# EAGLE schematic Esquematico (EAGLE 9.7.0)
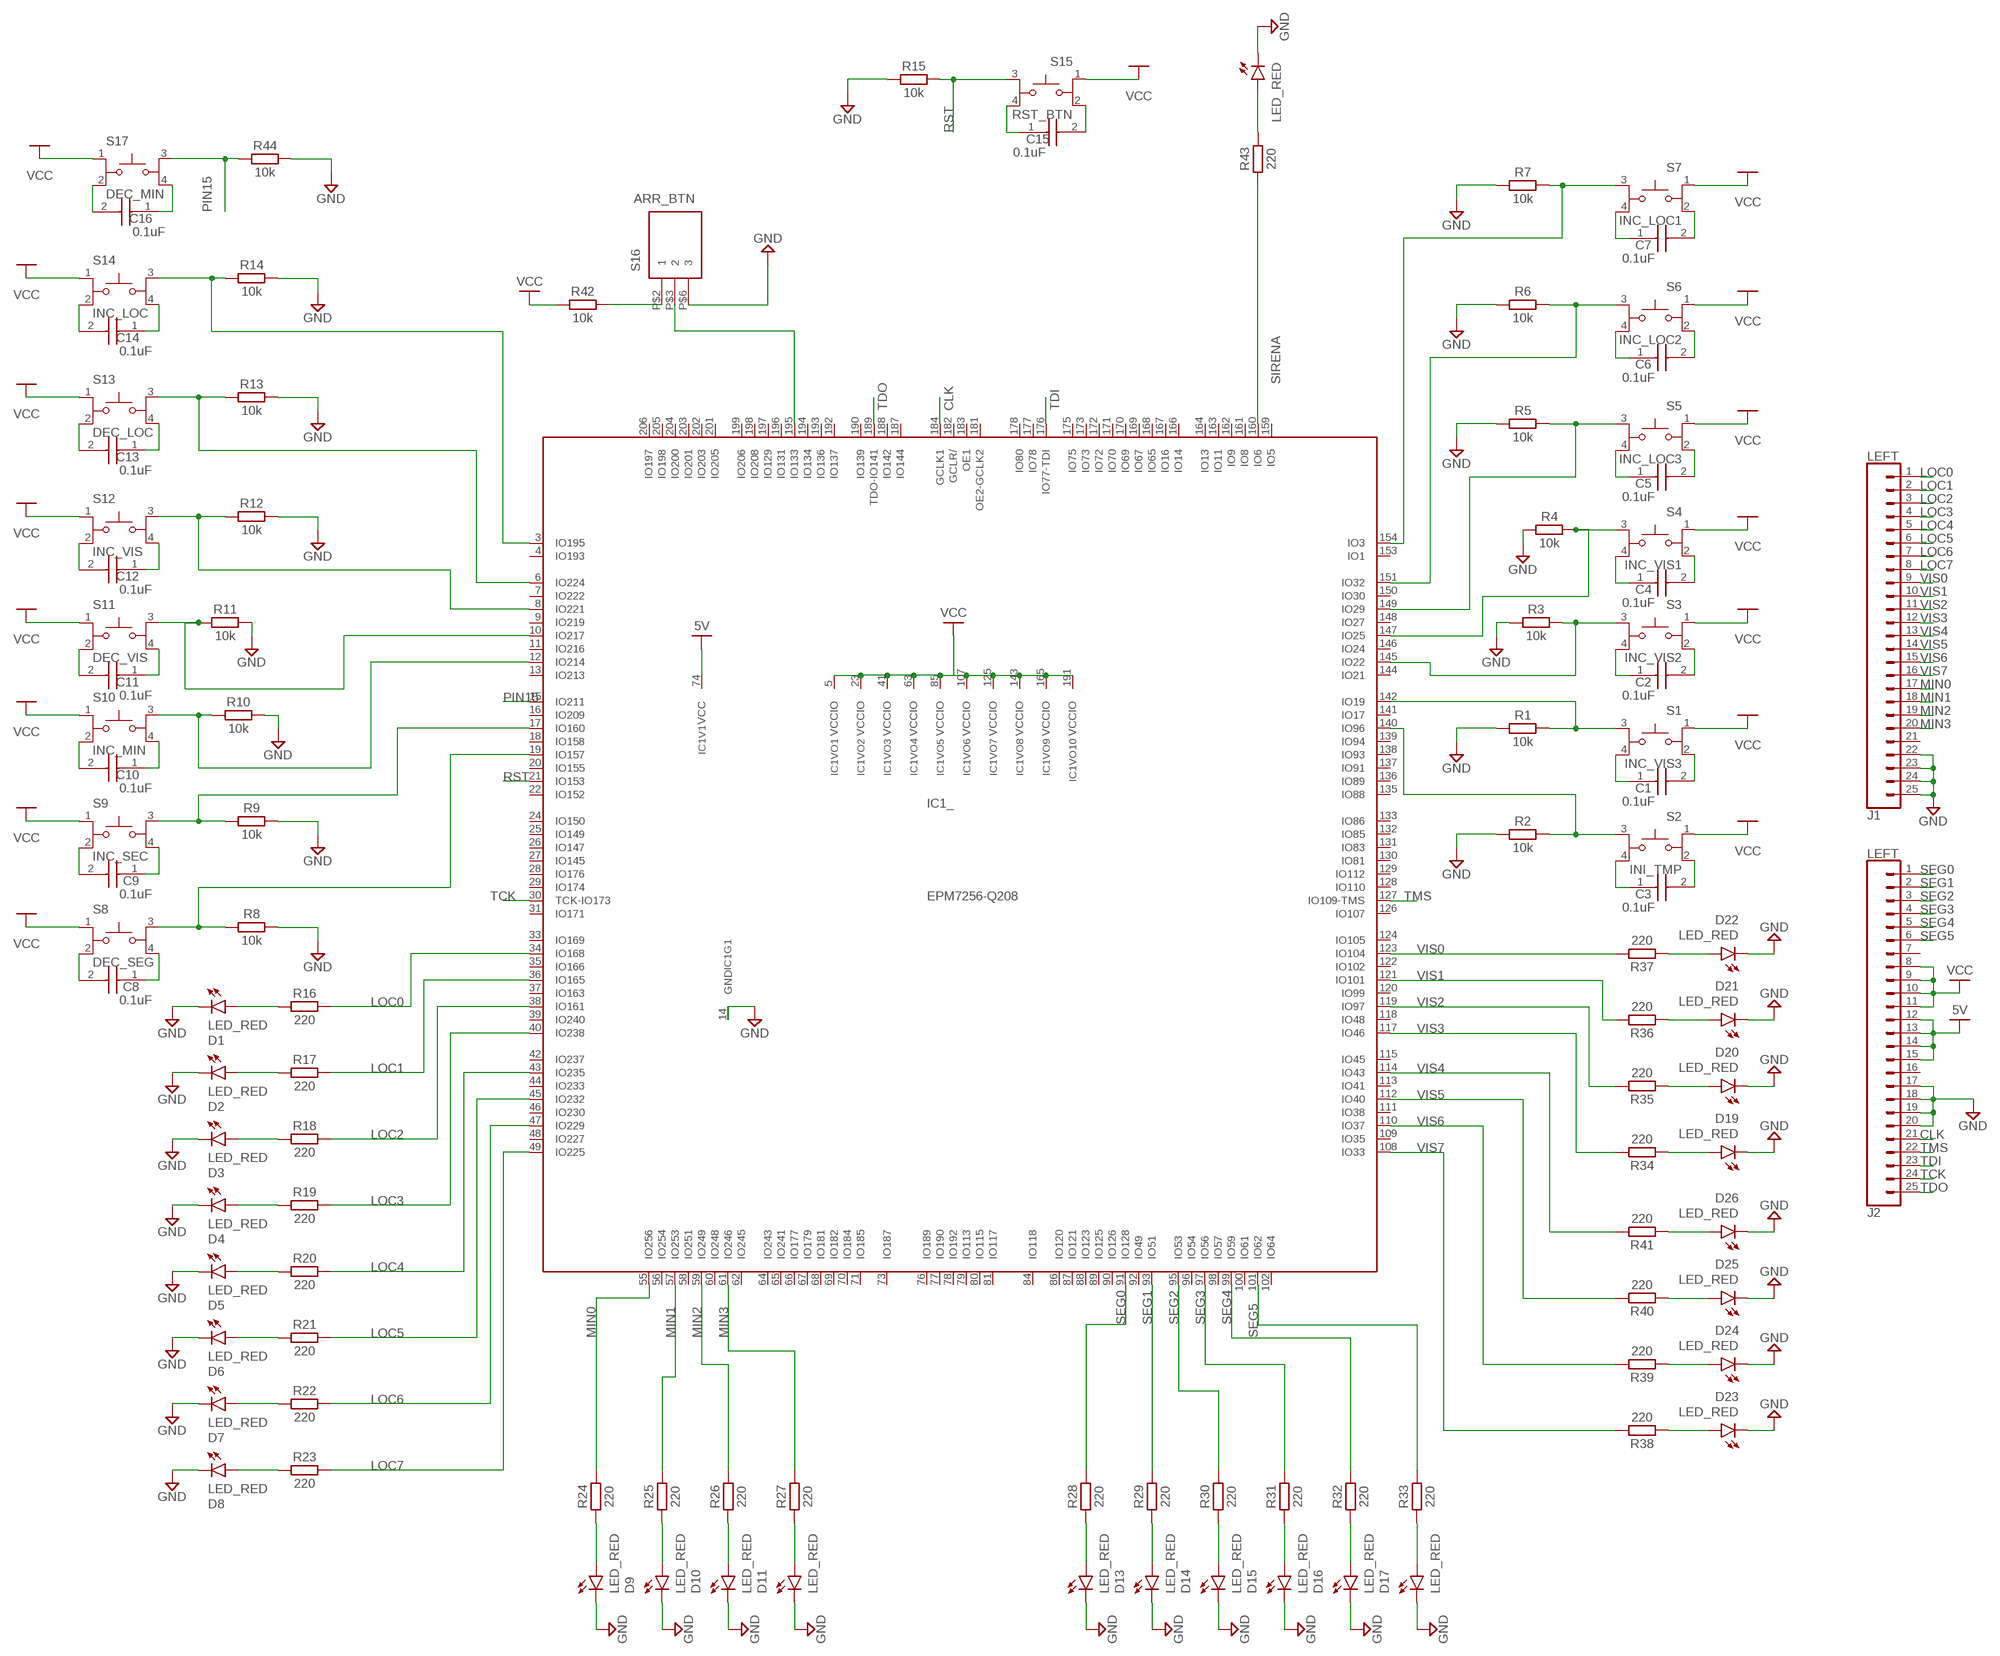
[diagram p0: schematic, sheet 1]

## Parts
C1  0.1uF  K104K15X7RF53H5  [K104K15X7RF53H5]
C2  0.1uF  K104K15X7RF53H5  [K104K15X7RF53H5]
C3  0.1uF  K104K15X7RF53H5  [K104K15X7RF53H5]
C4  0.1uF  K104K15X7RF53H5  [K104K15X7RF53H5]
C5  0.1uF  K104K15X7RF53H5  [K104K15X7RF53H5]
C6  0.1uF  K104K15X7RF53H5  [K104K15X7RF53H5]
C7  0.1uF  K104K15X7RF53H5  [K104K15X7RF53H5]
C8  0.1uF  K104K15X7RF53H5  [K104K15X7RF53H5]
C9  0.1uF  K104K15X7RF53H5  [K104K15X7RF53H5]
C10  0.1uF  K104K15X7RF53H5  [K104K15X7RF53H5]
C11  0.1uF  K104K15X7RF53H5  [K104K15X7RF53H5]
C12  0.1uF  K104K15X7RF53H5  [K104K15X7RF53H5]
C13  0.1uF  K104K15X7RF53H5  [K104K15X7RF53H5]
C14  0.1uF  K104K15X7RF53H5  [K104K15X7RF53H5]
C15  0.1uF  K104K15X7RF53H5  [K104K15X7RF53H5]
C16  0.1uF  K104K15X7RF53H5  [K104K15X7RF53H5]
D1  LED_RED  LED_RADIAL_RED  [LEDRD254W60D565H860B]
D2  LED_RED  LED_RADIAL_RED  [LEDRD254W60D565H860B]
D3  LED_RED  LED_RADIAL_RED  [LEDRD254W60D565H860B]
D4  LED_RED  LED_RADIAL_RED  [LEDRD254W60D565H860B]
D5  LED_RED  LED_RADIAL_RED  [LEDRD254W60D565H860B]
D6  LED_RED  LED_RADIAL_RED  [LEDRD254W60D565H860B]
D7  LED_RED  LED_RADIAL_RED  [LEDRD254W60D565H860B]
D8  LED_RED  LED_RADIAL_RED  [LEDRD254W60D565H860B]
D9  LED_RED  LED_RADIAL_RED  [LEDRD254W60D565H860B]
D10  LED_RED  LED_RADIAL_RED  [LEDRD254W60D565H860B]
D11  LED_RED  LED_RADIAL_RED  [LEDRD254W60D565H860B]
D12  LED_RED  LED_RADIAL_RED  [LEDRD254W60D565H860B]
D13  LED_RED  LED_RADIAL_RED  [LEDRD254W60D565H860B]
D14  LED_RED  LED_RADIAL_RED  [LEDRD254W60D565H860B]
D15  LED_RED  LED_RADIAL_RED  [LEDRD254W60D565H860B]
D16  LED_RED  LED_RADIAL_RED  [LEDRD254W60D565H860B]
D17  LED_RED  LED_RADIAL_RED  [LEDRD254W60D565H860B]
D18  LED_RED  LED_RADIAL_RED  [LEDRD254W60D565H860B]
D19  LED_RED  LED_RADIAL_RED  [LEDRD254W60D565H860B]
D20  LED_RED  LED_RADIAL_RED  [LEDRD254W60D565H860B]
D21  LED_RED  LED_RADIAL_RED  [LEDRD254W60D565H860B]
D22  LED_RED  LED_RADIAL_RED  [LEDRD254W60D565H860B]
D23  LED_RED  LED_RADIAL_RED  [LEDRD254W60D565H860B]
D24  LED_RED  LED_RADIAL_RED  [LEDRD254W60D565H860B]
D25  LED_RED  LED_RADIAL_RED  [LEDRD254W60D565H860B]
D26  LED_RED  LED_RADIAL_RED  [LEDRD254W60D565H860B]
D27  LED_RED  LED_RADIAL_RED  [LEDRD254W60D565H860B]
IC1  EPM7256-Q208  [RQFP208]
J1  LEFT  CONN_25PTH_LONGPADS  [1X25_LONGPAD]
J2  LEFT  CONN_25PTH_LONGPADS  [1X25_LONGPAD]
R1  10k  R_AXIAL-7.2MM-PITCH  [RESAD724W46L381D178B]
R2  10k  R_AXIAL-7.2MM-PITCH  [RESAD724W46L381D178B]
R3  10k  R_AXIAL-7.2MM-PITCH  [RESAD724W46L381D178B]
R4  10k  R_AXIAL-7.2MM-PITCH  [RESAD724W46L381D178B]
R5  10k  R_AXIAL-7.2MM-PITCH  [RESAD724W46L381D178B]
R6  10k  R_AXIAL-7.2MM-PITCH  [RESAD724W46L381D178B]
R7  10k  R_AXIAL-7.2MM-PITCH  [RESAD724W46L381D178B]
R8  10k  R_AXIAL-7.2MM-PITCH  [RESAD724W46L381D178B]
R9  10k  R_AXIAL-7.2MM-PITCH  [RESAD724W46L381D178B]
R10  10k  R_AXIAL-7.2MM-PITCH  [RESAD724W46L381D178B]
R11  10k  R_AXIAL-7.2MM-PITCH  [RESAD724W46L381D178B]
R12  10k  R_AXIAL-7.2MM-PITCH  [RESAD724W46L381D178B]
R13  10k  R_AXIAL-7.2MM-PITCH  [RESAD724W46L381D178B]
R14  10k  R_AXIAL-7.2MM-PITCH  [RESAD724W46L381D178B]
R15  10k  R_AXIAL-7.2MM-PITCH  [RESAD724W46L381D178B]
R16  220  R_AXIAL-7.2MM-PITCH  [RESAD724W46L381D178B]
R17  220  R_AXIAL-7.2MM-PITCH  [RESAD724W46L381D178B]
R18  220  R_AXIAL-7.2MM-PITCH  [RESAD724W46L381D178B]
R19  220  R_AXIAL-7.2MM-PITCH  [RESAD724W46L381D178B]
R20  220  R_AXIAL-7.2MM-PITCH  [RESAD724W46L381D178B]
R21  220  R_AXIAL-7.2MM-PITCH  [RESAD724W46L381D178B]
R22  220  R_AXIAL-7.2MM-PITCH  [RESAD724W46L381D178B]
R23  220  R_AXIAL-7.2MM-PITCH  [RESAD724W46L381D178B]
R24  220  R_AXIAL-7.2MM-PITCH  [RESAD724W46L381D178B]
R25  220  R_AXIAL-7.2MM-PITCH  [RESAD724W46L381D178B]
R26  220  R_AXIAL-7.2MM-PITCH  [RESAD724W46L381D178B]
R27  220  R_AXIAL-7.2MM-PITCH  [RESAD724W46L381D178B]
R28  220  R_AXIAL-7.2MM-PITCH  [RESAD724W46L381D178B]
R29  220  R_AXIAL-7.2MM-PITCH  [RESAD724W46L381D178B]
R30  220  R_AXIAL-7.2MM-PITCH  [RESAD724W46L381D178B]
R31  220  R_AXIAL-7.2MM-PITCH  [RESAD724W46L381D178B]
R32  220  R_AXIAL-7.2MM-PITCH  [RESAD724W46L381D178B]
R33  220  R_AXIAL-7.2MM-PITCH  [RESAD724W46L381D178B]
R34  220  R_AXIAL-7.2MM-PITCH  [RESAD724W46L381D178B]
R35  220  R_AXIAL-7.2MM-PITCH  [RESAD724W46L381D178B]
R36  220  R_AXIAL-7.2MM-PITCH  [RESAD724W46L381D178B]
R37  220  R_AXIAL-7.2MM-PITCH  [RESAD724W46L381D178B]
R38  220  R_AXIAL-7.2MM-PITCH  [RESAD724W46L381D178B]
R39  220  R_AXIAL-7.2MM-PITCH  [RESAD724W46L381D178B]
R40  220  R_AXIAL-7.2MM-PITCH  [RESAD724W46L381D178B]
R41  220  R_AXIAL-7.2MM-PITCH  [RESAD724W46L381D178B]
R42  10k  R_AXIAL-7.2MM-PITCH  [RESAD724W46L381D178B]
R43  220  R_AXIAL-7.2MM-PITCH  [RESAD724W46L381D178B]
R44  10k  R_AXIAL-7.2MM-PITCH  [RESAD724W46L381D178B]
S1  INC_VIS3  TL1100F160Q  [SW_TL1100F160Q]
S2  INI_TMP  TL1100F160Q  [SW_TL1100F160Q]
S3  INC_VIS2  TL1100F160Q  [SW_TL1100F160Q]
S4  INC_VIS1  TL1100F160Q  [SW_TL1100F160Q]
S5  INC_LOC3  TL1100F160Q  [SW_TL1100F160Q]
S6  INC_LOC2  TL1100F160Q  [SW_TL1100F160Q]
S7  INC_LOC1  TL1100F160Q  [SW_TL1100F160Q]
S8  DEC_SEG  TL1100F160Q  [SW_TL1100F160Q]
S9  INC_SEC  TL1100F160Q  [SW_TL1100F160Q]
S10  INC_MIN  TL1100F160Q  [SW_TL1100F160Q]
S11  DEC_VIS  TL1100F160Q  [SW_TL1100F160Q]
S12  INC_VIS  TL1100F160Q  [SW_TL1100F160Q]
S13  DEC_LOC  TL1100F160Q  [SW_TL1100F160Q]
S14  INC_LOC  TL1100F160Q  [SW_TL1100F160Q]
S15  RST_BTN  TL1100F160Q  [SW_TL1100F160Q]
S16  ARR_BTN  734-7306  [7347306]
S17  DEC_MIN  TL1100F160Q  [SW_TL1100F160Q]

## Nets
5V [pwr]: IC1.74(V1:VCC) J2.12 J2.13 J2.14 J2.15
CLK: IC1.184(_:GCLK1) J2.21
GND [pwr]: D1.2(C) D2.2(C) D3.2(C) D4.2(C) D5.2(C) D6.2(C) D7.2(C) D8.2(C) D9.2(C) D10.2(C) D11.2(C) D12.2(C) D13.2(C) D14.2(C) D15.2(C) D16.2(C) D17.2(C) D18.2(C) D19.2(C) D20.2(C) D21.2(C) D22.2(C) D23.2(C) D24.2(C) D25.2(C) D26.2(C) D27.2(C) IC1.14(GND) J1.22 J1.23 J1.24 J1.25 J2.17 J2.18 J2.19 J2.20 R1.2 R2.2 R3.2 R4.2 R5.2 R6.2 R7.2 R8.2 R9.2 R10.2 R11.2 R12.2 R13.2 R14.2 R15.2 R44.2 S16.P$6
LOC0: IC1.34(_:IO168) J1.1 R16.1
LOC1: IC1.36(_:IO165) J1.2 R17.1
LOC2: IC1.38(_:IO161) J1.3 R18.1
LOC3: IC1.40(_:IO238) J1.4 R19.1
LOC4: IC1.43(_:IO235) J1.5 R20.1
LOC5: IC1.45(_:IO232) J1.6 R21.1
LOC6: IC1.47(_:IO229) J1.7 R22.1
LOC7: IC1.49(_:IO225) J1.8 R23.1
MIN0: IC1.55(_:IO256) J1.17 R24.1
MIN1: IC1.57(_:IO253) J1.18 R25.1
MIN2: IC1.59(_:IO249) J1.19 R26.1
MIN3: IC1.61(_:IO246) J1.20 R27.1
N$1: IC1.3(_:IO195) R14.1 S14.3
N$2: IC1.10(_:IO217) R11.1 S11.3
N$3: IC1.142(_:IO19) R1.1 S1.3
N$4: C1.1 S1.4
N$5: C1.2 S1.2
N$6: IC1.140(_:IO96) R2.1 S2.3
N$7: C2.1 S3.4
N$8: C3.1 S2.4
N$9: IC1.145(_:IO22) R3.1 S3.3
N$10: C3.2 S2.2
N$11: C2.2 S3.2
N$12: IC1.147(_:IO25) R4.1 S4.3
N$13: C4.1 S4.4
N$14: C4.2 S4.2
N$15: IC1.8(_:IO221) R12.1 S12.3
N$16: C5.1 S5.4
N$17: C5.2 S5.2
N$18: IC1.151(_:IO32) R6.1 S6.3
N$19: IC1.149(_:IO29) R5.1 S5.3
N$20: C6.1 S6.4
N$21: IC1.19(_:IO157) R8.1 S8.3
N$22: C8.1 S8.4
N$23: C8.2 S8.2
N$24: C15.1 S15.4
N$25: IC1.17(_:IO160) R9.1 S9.3
N$26: C9.1 S9.4
N$27: C9.2 S9.2
N$28: C10.1 S10.4
N$29: C10.2 S10.2
N$30: C11.1 S11.4
N$31: C11.2 S11.2
N$32: C12.1 S12.4
N$33: C12.2 S12.2
N$34: IC1.6(_:IO224) R13.1 S13.3
N$35: C13.1 S13.4
N$36: C13.2 S13.2
N$37: C15.2 S15.2
N$38: C14.1 S14.4
N$39: C16.1 S17.4
N$40: C14.2 S14.2
N$41: IC1.12(_:IO214) R10.1 S10.3
N$42: C16.2 S17.2
N$45: D1.1(A) R16.2
N$46: D2.1(A) R17.2
N$47: D3.1(A) R18.2
N$48: D4.1(A) R19.2
N$49: D5.1(A) R20.2
N$50: D6.1(A) R21.2
N$51: D7.1(A) R22.2
N$52: D8.1(A) R23.2
N$53: D27.1(A) R43.2
N$54: C6.2 S6.2
N$55: IC1.154(_:IO3) R7.1 S7.3
N$56: C7.1 S7.4
N$57: C7.2 S7.2
N$61: D9.1(A) R24.2
N$62: D10.1(A) R25.2
N$63: D11.1(A) R26.2
N$64: D12.1(A) R27.2
N$65: D13.1(A) R28.2
N$66: D14.1(A) R29.2
N$67: D15.1(A) R30.2
N$68: D16.1(A) R31.2
N$78: D17.1(A) R32.2
N$79: D18.1(A) R33.2
N$80: D19.1(A) R34.2
N$81: D20.1(A) R35.2
N$84: D21.1(A) R36.2
N$85: D22.1(A) R37.2
N$90: D23.1(A) R38.2
N$91: D24.1(A) R39.2
N$92: D25.1(A) R40.2
N$93: D26.1(A) R41.2
N$98: IC1.195(_:IO133) S16.P$3
N$99: R42.1 S16.P$2
PIN15: IC1.15(_:IO211) R44.1 S17.3
RST: IC1.21(_:IO153) R15.1 S15.3
SEG0: IC1.91(_:IO128) J2.1 R28.1
SEG1: IC1.93(_:IO51) J2.2 R29.1
SEG2: IC1.95(_:IO53) J2.3 R30.1
SEG3: IC1.97(_:IO56) J2.4 R31.1
SEG4: IC1.99(_:IO59) J2.5 R32.1
SEG5: IC1.101(_:IO62) J2.6 R33.1
SIRENA: IC1.160(_:IO6) R43.1
TCK: IC1.30(_:TCK-IO173) J2.24
TDI: IC1.176(_:IO77-TDI) J2.23
TDO: IC1.189(_:TDO-IO141) J2.25
TMS: IC1.127(_:IO109-TMS) J2.22
VCC [pwr]: IC1.5(VO1:VCCIO) IC1.23(VO2:VCCIO) IC1.41(VO3:VCCIO) IC1.63(VO4:VCCIO) IC1.85(VO5:VCCIO) IC1.107(VO6:VCCIO) IC1.125(VO7:VCCIO) IC1.143(VO8:VCCIO) IC1.165(VO9:VCCIO) IC1.191(VO10:VCCIO) J2.8 J2.9 J2.10 J2.11 R42.2 S1.1 S2.1 S3.1 S4.1 S5.1 S6.1 S7.1 S8.1 S9.1 S10.1 S11.1 S12.1 S13.1 S14.1 S15.1 S17.1
VIS0: IC1.123(_:IO104) J1.9 R37.1
VIS1: IC1.121(_:IO101) J1.10 R36.1
VIS2: IC1.119(_:IO97) J1.11 R35.1
VIS3: IC1.117(_:IO46) J1.12 R34.1
VIS4: IC1.114(_:IO43) J1.13 R41.1
VIS5: IC1.112(_:IO40) J1.14 R40.1
VIS6: IC1.110(_:IO37) J1.15 R39.1
VIS7: IC1.108(_:IO33) J1.16 R38.1
Unconnected: IC1.1(NC1:NC) IC1.2(NC2:NC) IC1.4(_:IO193) IC1.7(_:IO222) IC1.9(_:IO219) IC1.11(_:IO216) IC1.13(_:IO213) IC1.16(_:IO209) IC1.18(_:IO158) IC1.20(_:IO155) IC1.22(_:IO152) IC1.24(_:IO150) IC1.25(_:IO149) IC1.26(_:IO147) IC1.27(_:IO145) IC1.28(_:IO176) IC1.29(_:IO174) IC1.31(_:IO171) IC1.33(_:IO169) IC1.35(_:IO166) IC1.37(_:IO163) IC1.39(_:IO240) IC1.42(_:IO237) IC1.44(_:IO233) IC1.46(_:IO230) IC1.48(_:IO227) IC1.51(NC3:NC) IC1.52(NC4:NC) IC1.53(NC5:NC) IC1.54(NC6:NC) IC1.56(_:IO254) IC1.58(_:IO251) IC1.60(_:IO248) IC1.62(_:IO245) IC1.64(_:IO243) IC1.65(_:IO241) IC1.66(_:IO177) IC1.67(_:IO179) IC1.68(_:IO181) IC1.69(_:IO182) IC1.70(_:IO184) IC1.71(_:IO185) IC1.73(_:IO187) IC1.76(_:IO189) IC1.77(_:IO190) IC1.78(_:IO192) IC1.79(_:IO113) IC1.80(_:IO115) IC1.81(_:IO117) IC1.84(_:IO118) IC1.86(_:IO120) IC1.87(_:IO121) IC1.88(_:IO123) IC1.89(_:IO125) IC1.90(_:IO126) IC1.92(_:IO49) IC1.96(_:IO54) IC1.98(_:IO57) IC1.100(_:IO61) IC1.102(_:IO64) IC1.103(NC7:NC) IC1.104(NC8:NC) IC1.105(NC9:NC) IC1.106(NC10:NC) IC1.109(_:IO35) IC1.111(_:IO38) IC1.113(_:IO41) IC1.115(_:IO45) IC1.118(_:IO48) IC1.120(_:IO99) IC1.122(_:IO102) IC1.124(_:IO105) IC1.126(_:IO107) IC1.128(_:IO110) IC1.129(_:IO112) IC1.130(_:IO81) IC1.131(_:IO83) IC1.132(_:IO85) IC1.133(_:IO86) IC1.135(_:IO88) IC1.136(_:IO89) IC1.137(_:IO91) IC1.138(_:IO93) IC1.139(_:IO94) IC1.141(_:IO17) IC1.144(_:IO21) IC1.146(_:IO24) IC1.148(_:IO27) IC1.150(_:IO30) IC1.153(_:IO1) IC1.155(NC11:NC) IC1.156(NC12:NC) IC1.157(NC13:NC) IC1.158(NC14:NC) IC1.159(_:IO5) IC1.161(_:IO8) IC1.162(_:IO9) IC1.163(_:IO11) IC1.164(_:IO13) IC1.166(_:IO14) IC1.167(_:IO16) IC1.168(_:IO65) IC1.169(_:IO67) IC1.170(_:IO69) IC1.171(_:IO70) IC1.172(_:IO72) IC1.173(_:IO73) IC1.175(_:IO75) IC1.177(_:IO78) IC1.178(_:IO80) IC1.181(_:OE2-GCLK2) IC1.182(_:GCLR/) IC1.183(_:OE1) IC1.187(_:IO144) IC1.188(_:IO142) IC1.190(_:IO139) IC1.192(_:IO137) IC1.193(_:IO136) IC1.194(_:IO134) IC1.196(_:IO131) IC1.197(_:IO129) IC1.198(_:IO208) IC1.199(_:IO206) IC1.201(_:IO205) IC1.202(_:IO203) IC1.203(_:IO201) IC1.204(_:IO200) IC1.205(_:IO198) IC1.206(_:IO197) IC1.207(NC15:NC) IC1.208(NC16:NC) J1.21 J2.7 J2.16

## Power pins joined to a net without a drawn wire
GND: IC1.32(GND) IC1.50(GND) IC1.72(GND) IC1.75(GND) IC1.82(GND) IC1.94(GND) IC1.116(GND) IC1.134(GND) IC1.152(GND) IC1.174(GND) IC1.180(GND) IC1.185(GND) IC1.200(GND)
VCC: IC1.83(V2:VCC) IC1.179(V3:VCC) IC1.186(V4:VCC)

## Library data of the parts
C1-C16 = Library_Capacitor_Ceramico:K104K15X7RF53H5: Vishay 100nF Multilayer Ceramic Capacitor MLCC 50V dc +/-10% Through Hole K104K15X7RF53H5 Source: Datasheet <http://www.vishay.com/docs/45171/kseries.pdf>; ARROW_PART_NUMBER: K104K15X7RF53H5; ARROW_PRICE-STOCK: https://www.arrow.com/en/products/k104k15x7rf53h5/vishay?region=nac; DESCRIPTION: Vishay 100nF Multilayer Ceramic Capacitor MLCC 50V dc +/-10% Through Hole K104K15X7RF53H5; HEIGHT: mm; MANUFACTURER_NAME: Vishay; MANUFACTURER_PART_NUMBER: K104K15X7RF53H5; MOUSER_PART_NUMBER: 594-K104K15X7RF53H5; MOUSER_PRICE-STOCK: https://www.mouser.co.uk/ProductDetail/Vishay-BC-Components/K104K15X7RF53H5?qs=sYfpZ29HcUSlgH5bSUHkYw%3D%3D
D1-D27 = Opto-Electronic:LED_RADIAL: LED - Generic; CATEGORY: Opto-Electronic; SUB-CATEGORY: LED
IC1 = altera:EPM7256-Q208: EPM7256S MAX 7000 family; MPN: EPM7256AEQC208-10N; OC_FARNELL: 1549440; OC_NEWARK: 51R9842
J1 J2 = SparkFun-Connectors:CONN_25: Multi connection point. Often used as Generic Header-pin footprint for 0.1 inch spaced/style header connections On any of the 0.1 inch spaced packages, you can populate with these: Break Away Headers - Straight <https://www.sparkfun.com/products/116> (PRT-00116) Break Away Male Headers - Right Angle <https://www.sparkfun.com/products/553> (PRT-00553) Female Headers <https://www.sparkfun.com/products/115> (PRT-00115) Break Away Headers - Machine Pin <https://www.sparkfun.com/products/117> (PRT-00117) Break Away Female Headers - Swiss Machine Pin <https://www.sparkfun.com/products/743> (PRT-00743) For SCREWTERMINALS and SPRING TERMINALS visit here: Screw Terimnals on SparkFun.com <https://www.sparkfun.com/search/results?term=Screw+Terminals> (5mm/3.5mm/2.54mm spacing) This device is also useful as a general connection point to wire up your design to another part of your project. Our various solder wires solder well into these plated through hole pads. Hook-Up Wire - Assortment (Stranded, 22 AWG) <https://www.sparkfun.com/products/11375> (PRT-11375) Hook-Up Wire - Assortment (Solid Core, 22 AWG) <https://www.sparkfun.com/products/11367> (PRT-11367) View the entire wire category on our website here <https://www.sparkfun.com/categories/141> Special notes: Molex polarized connector foot print use with SKU : PRT-08231 with associated crimp pins and housings. 1MM SMD Version SKU: PRT-10208 NOTES ON THE VARIANTS LOCK and LOCK_LONGPADS... This footprint was designed to help hold the alignment of a through-hole component (i.e. 6-pin header) while soldering it into place. You may notice that each hole has been shifted either up or down by 0.005 of an inch from it's more standard position (which is a perfectly straight line). This slight alteration caused the pins (the squares in the middle) to touch the edges of the holes. Because they are alternating, it causes a "brace" to hold the component in place. 0.005 has proven to be the perfect amount of "off-center" position when using our standard breakaway headers. Although looks a little odd when you look at the bare footprint, once you have a header in there, the alteration is very hard to notice. Also,if you push a header all the way into place, it is covered up entirely on the bottom side.
R1-R44 = Resistor:R: Resistor Fixed - Generic; CATEGORY: Resistor; SUB-CATEGORY: Fixed
S1-S15 S17 = SnapEDA Library:TL1100F160Q; MANUFACTURER: E-Switch; MAXIMUM_PACKAGE_HEIGHT: 7.3mm; PARTREV: D; SNAPEDA_PN: TL1100F160Q; STANDARD: Manufacturer Recommendations
S16 = Library_Switch:734-7306: SPDT Slide Switch Source: Datasheet; DESCRIPTION: SPDT Slide Switch; HEIGHT: 12.7mm; MANUFACTURER_NAME: RS Components; MANUFACTURER_PART_NUMBER: 734-7306

## Net classes
0 default: width 1.016 mm, drill 1.016 mm, clearance 0.762 mm
1 pwr: width 0.381 mm, drill 0.381 mm, clearance 0.381 mm